# EAGLE schematic shield board (EAGLE 9.5.1)
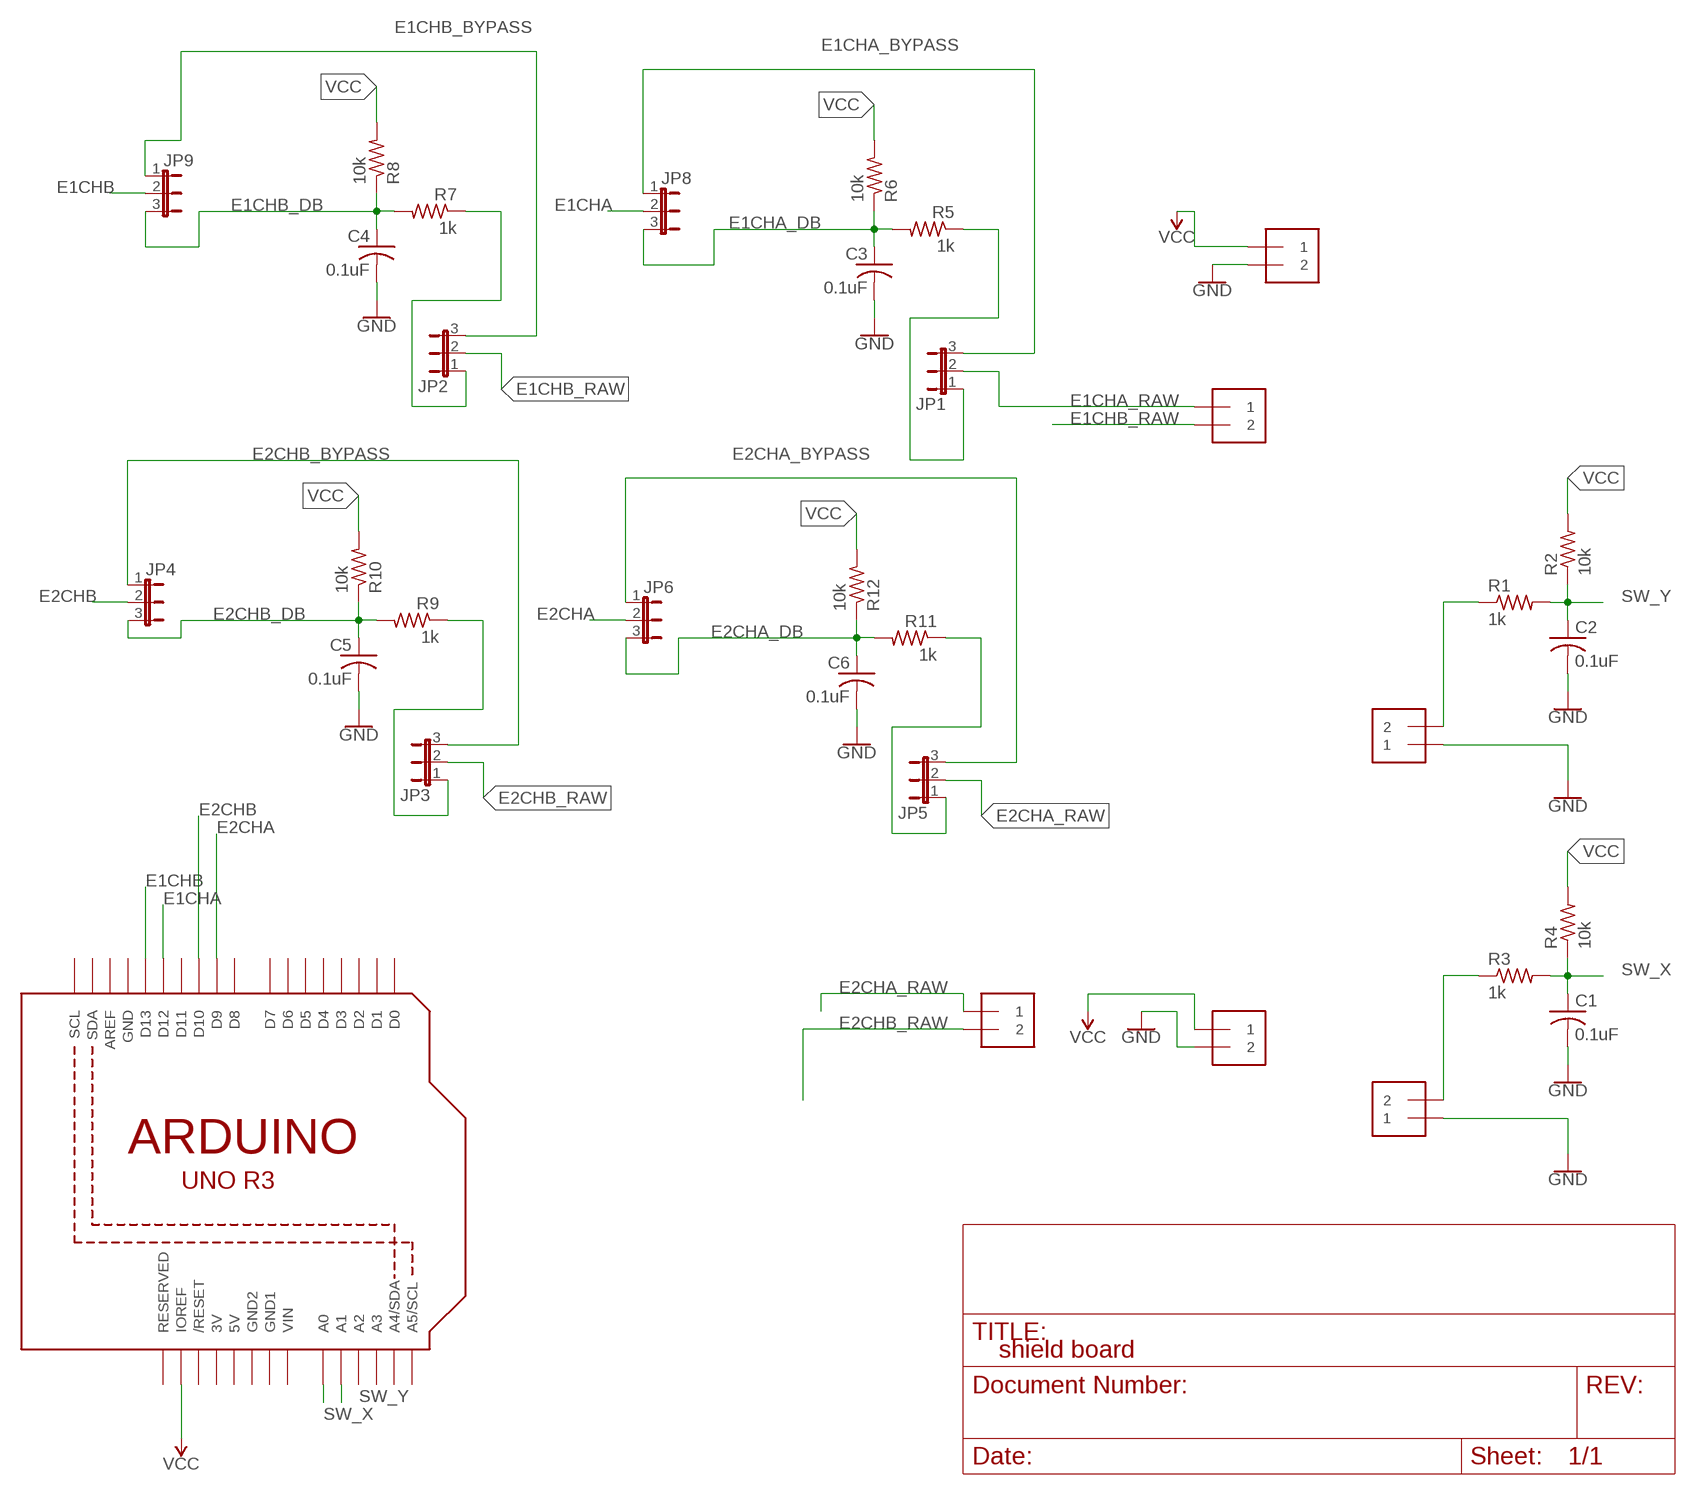
[diagram p0: schematic, sheet 1]

## Parts
C1  0.1uF  C-USC0603  [C0603]
C2  0.1uF  C-USC0603  [C0603]
C3  0.1uF  C-USC0603  [C0603]
C4  0.1uF  C-USC0603  [C0603]
C5  0.1uF  C-USC0603  [C0603]
C6  0.1uF  C-USC0603  [C0603]
JP1  JP2E  [JP2]
JP2  JP2E  [JP2]
JP3  JP2E  [JP2]
JP4  JP2E  [JP2]
JP5  JP2E  [JP2]
JP6  JP2E  [JP2]
JP8  JP2E  [JP2]
JP9  JP2E  [JP2]
R1  1k  R-US_R0603  [R0603]
R2  10k  R-US_R0603  [R0603]
R3  1k  R-US_R0603  [R0603]
R4  10k  R-US_R0603  [R0603]
R5  1k  R-US_R0603  [R0603]
R6  10k  R-US_R0603  [R0603]
R7  1k  R-US_R0603  [R0603]
R8  10k  R-US_R0603  [R0603]
R9  1k  R-US_R0603  [R0603]
R10  10k  R-US_R0603  [R0603]
R11  1k  R-US_R0603  [R0603]
R12  10k  R-US_R0603  [R0603]
U1  ARDUINOR3-BPLACE  [ARDUINOR3-BPLACE]
U$1  MOLEX_0039301022  [MINI-FIT_JR_CONN]
U$2  MOLEX_0039301022  [MINI-FIT_JR_CONN]
U$3  MOLEX_0039301022  [MINI-FIT_JR_CONN]
U$4  MOLEX_0039301022  [MINI-FIT_JR_CONN]
U$5  MOLEX_0039301022  [MINI-FIT_JR_CONN]
U$6  MOLEX_0039301022  [MINI-FIT_JR_CONN]

## Nets
E1CHA: JP8.2 U1.D12
E1CHA_BYPASS: JP1.3 JP8.1
E1CHA_DB: C3.1 JP8.3 R5.2 R6.1
E1CHA_RAW: JP1.2 U$5.P$2
E1CHB: JP9.2 U1.D13
E1CHB_BYPASS: JP2.3 JP9.1
E1CHB_DB: C4.1 JP9.3 R7.2 R8.1
E1CHB_RAW: JP2.2 U$5.P$1
E2CHA: JP6.2 U1.D9
E2CHA_BYPASS: JP5.3 JP6.1
E2CHA_DB: C6.1 JP6.3 R11.2 R12.1
E2CHA_RAW: JP5.2 U$6.P$2
E2CHB: JP4.2 U1.D10
E2CHB_BYPASS: JP3.3 JP4.1
E2CHB_DB: C5.1 JP4.3 R9.2 R10.1
E2CHB_RAW: JP3.2 U$6.P$1
GND: C1.2 C2.2 C3.2 C4.2 C5.2 C6.2 U$1.P$2 U$2.P$2 U$3.P$1 U$4.P$1
N$1: R1.1 U$1.P$1
N$2: JP1.1 R5.1
N$3: JP2.1 R7.1
N$4: R3.1 U$2.P$1
N$5: JP3.1 R9.1
N$6: JP5.1 R11.1
SW_X: C1.1 R3.2 R4.1 U1.A0
SW_Y: C2.1 R1.2 R2.1 U1.A1
VCC: R2.2 R4.2 R6.2 R8.2 R10.2 R12.2 U1.IOREF U$3.P$2 U$4.P$2
Unconnected: U1.A2 U1.A3 U1.A4(A4/SDA) U1.A5(A5/SCL) U1.AREF U1.D0 U1.D1 U1.D2 U1.D3 U1.D4 U1.D5 U1.D6 U1.D7 U1.D8 U1.D11 U1.RESERVED U1.RESET(/RESET) U1.SCL U1.SDA

## Power pins joined to a net without a drawn wire
3V: U1.3V
5V: U1.5V
GND: U1.GND
GND1: U1.GND1
GND2: U1.GND2
VIN: U1.VIN

## Library data of the parts
C1-C6 = adafruit:C-US: CAPACITOR, American symbol
JP1-JP6 JP8 JP9 = jumper:JP2E: JUMPER
R1-R12 = resistor:R-US_: RESISTOR, American symbol
U1 = adafruit:ARDUINOR3: This is a new object for the new Arduino R3 - with extra pins that you may want to use (such as IOref, and duplicated A4/A5
U$1-U$6 = pat:MOLEX_0039301022